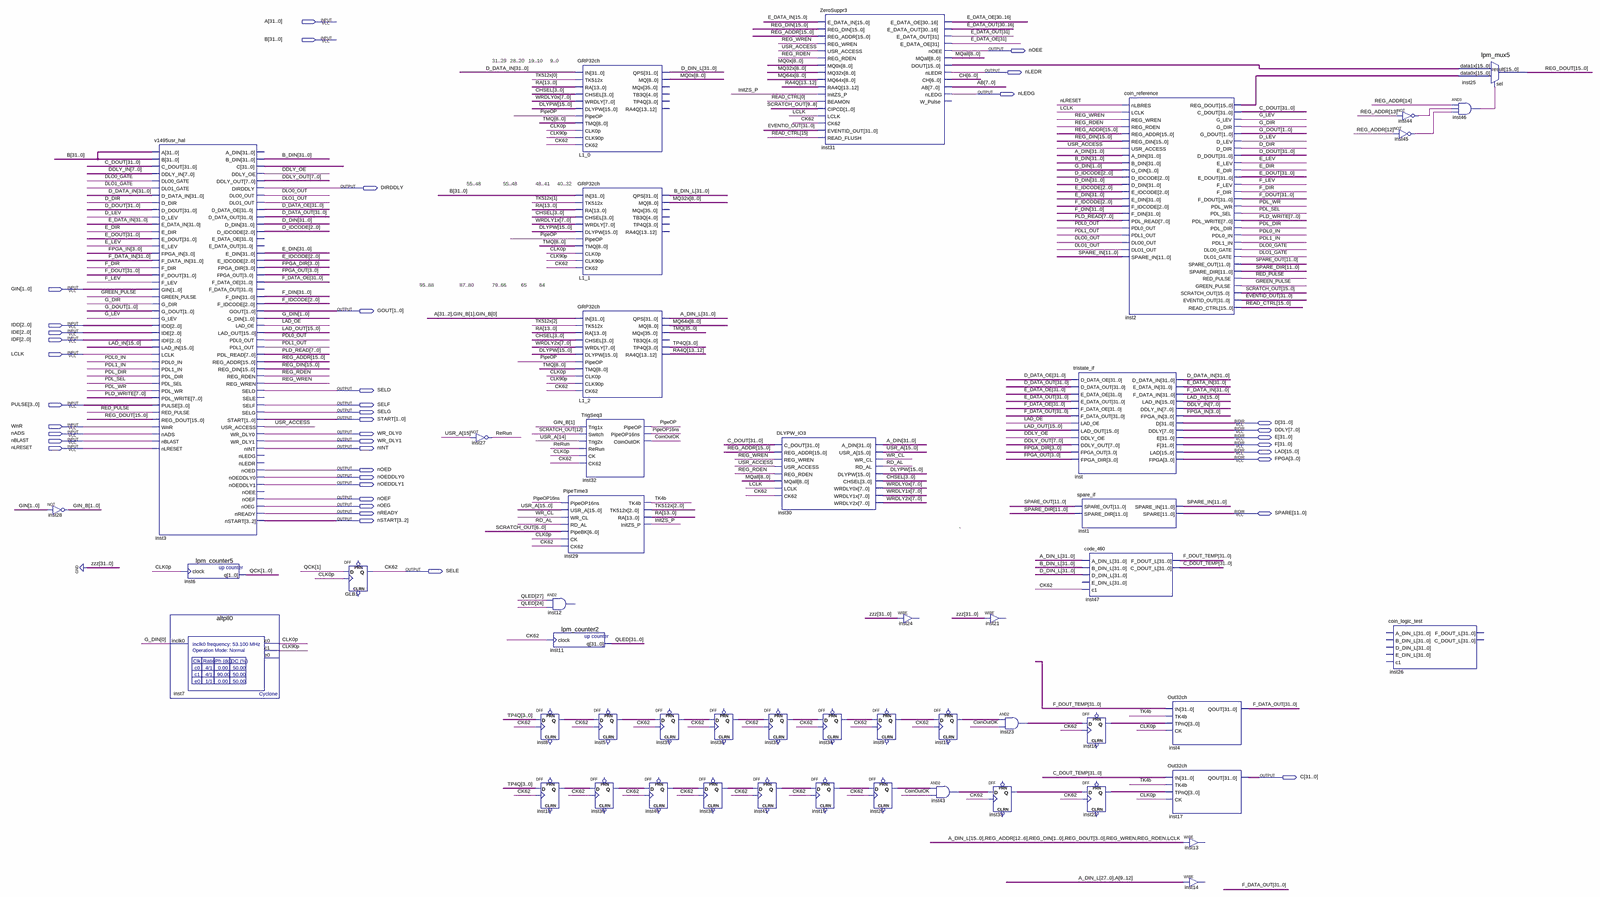
[diagram p0: schematic sheet, whole]
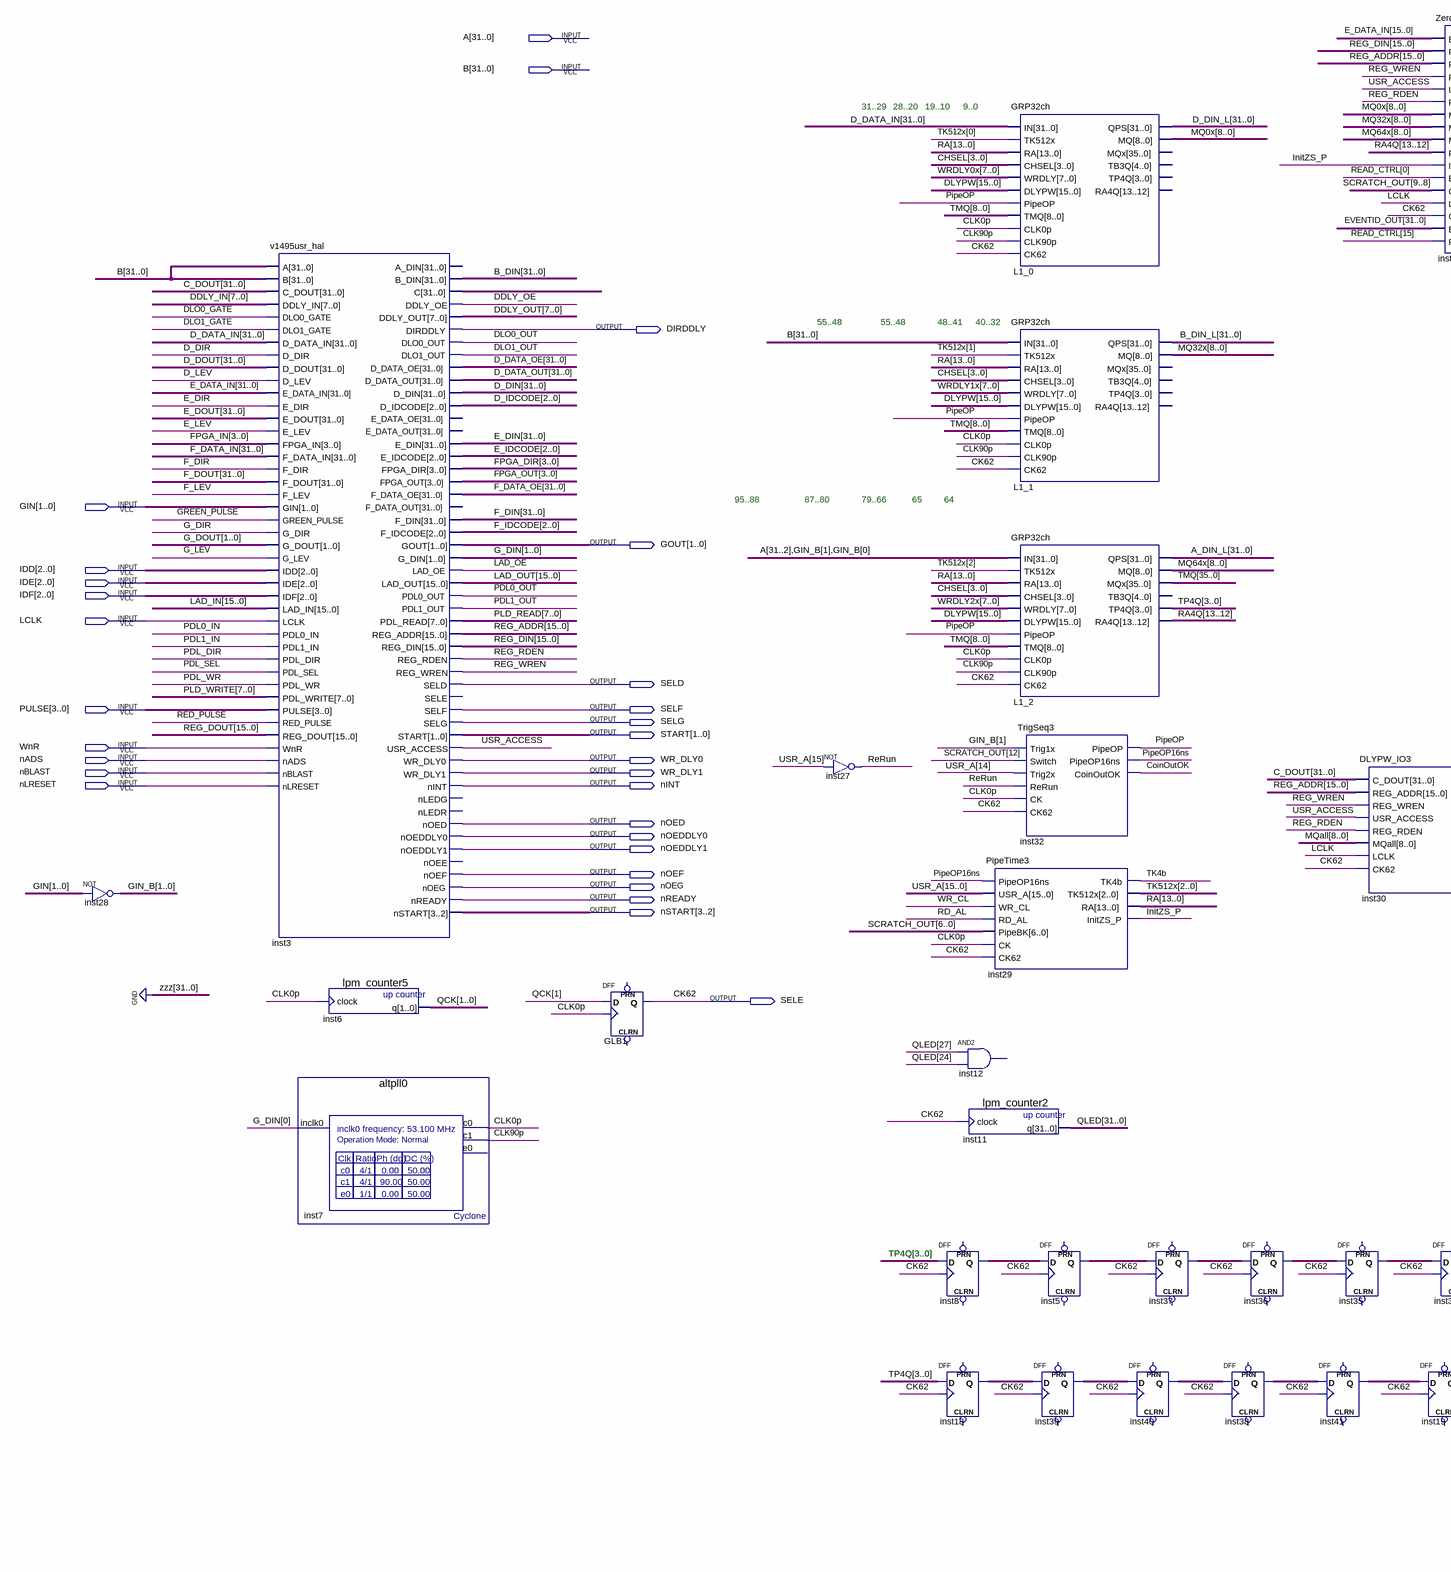
[diagram p1: schematic sheet, left part]
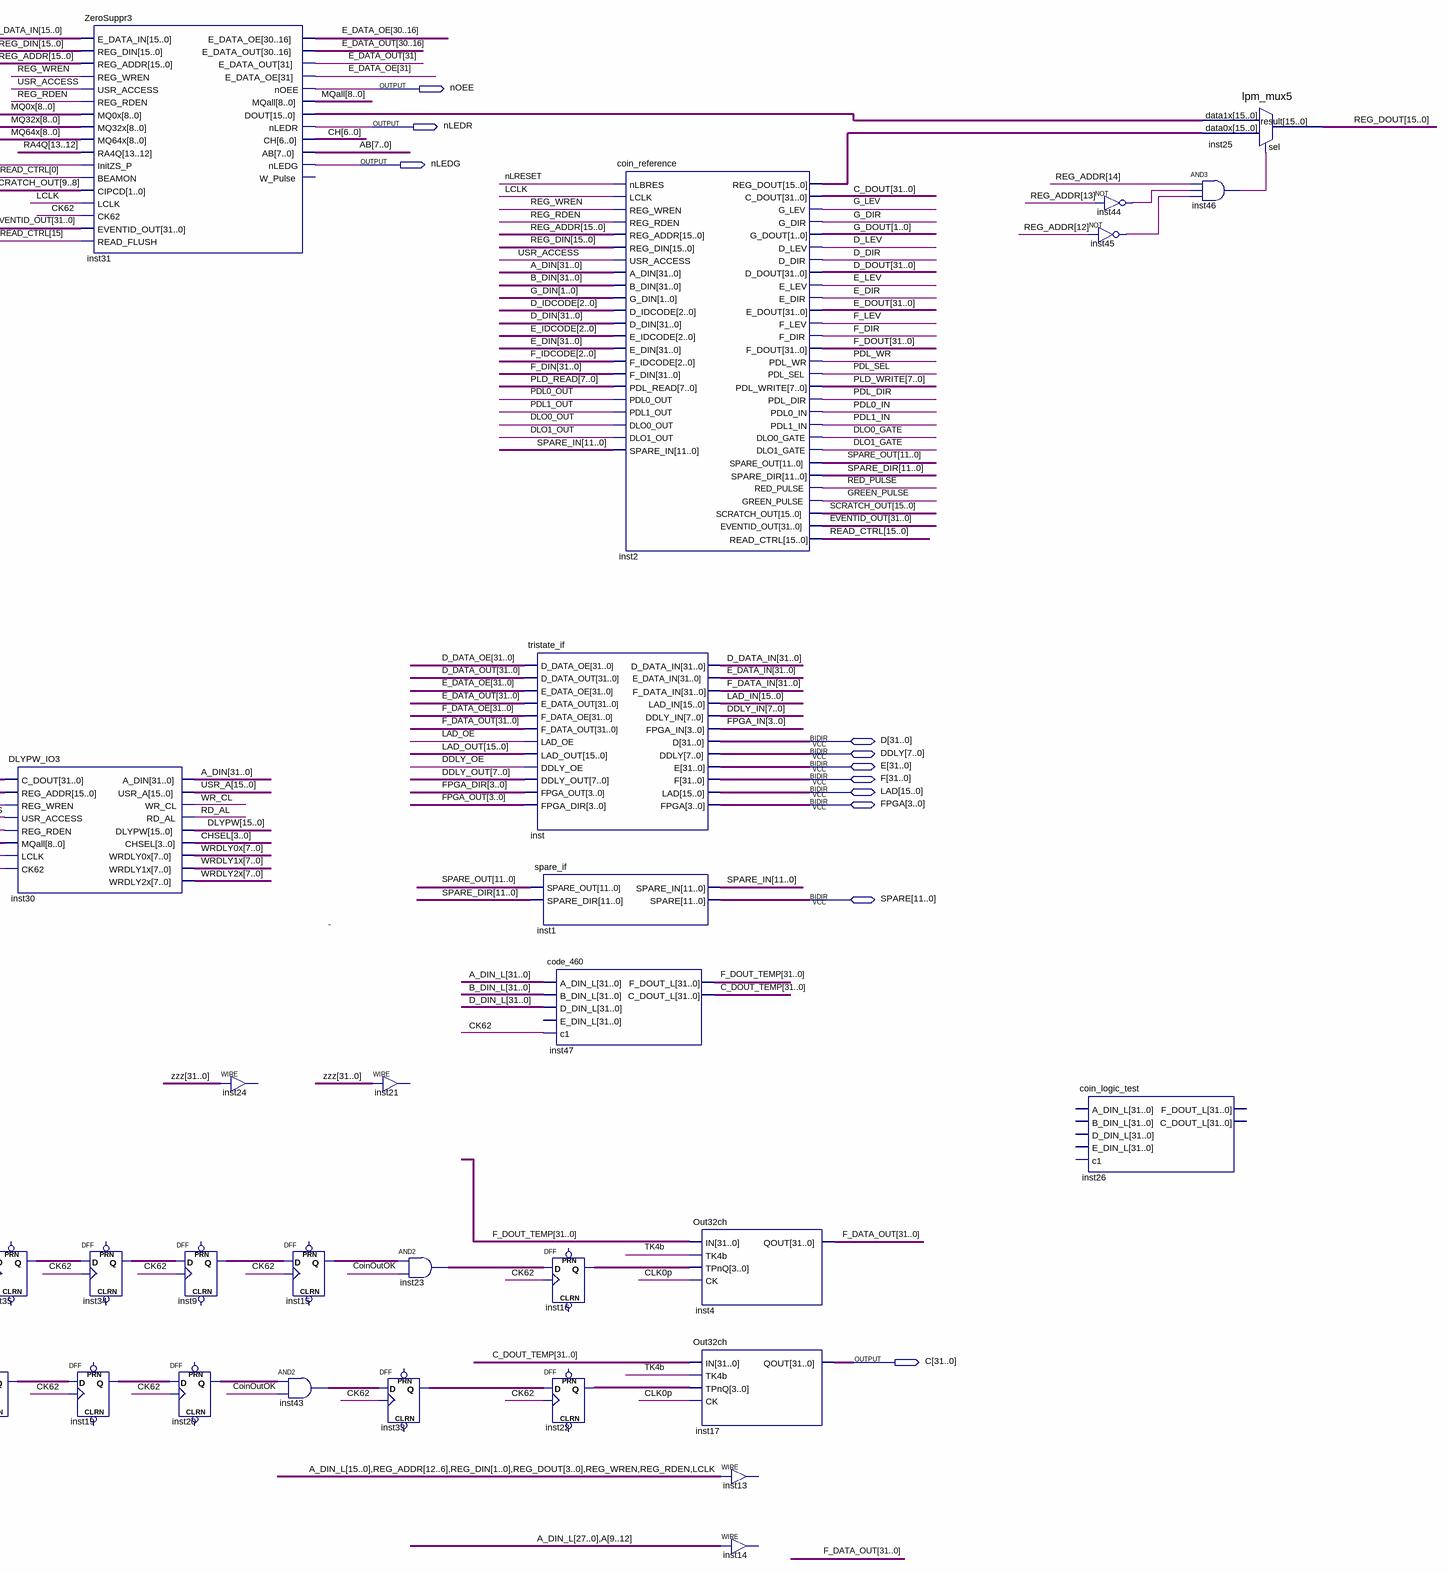
[diagram p2: schematic sheet, right part]
// Quartus schematic SeaQuestTrig2.bdf as structural Verilog: 50 symbols, 40 pins
module SeaQuestTrig2 (
  input  [31:0] A,
  input  [31:0] B,
  input  [1:0] GIN,
  input  [2:0] IDD,
  input  [2:0] IDE,
  input  [2:0] IDF,
  input  LCLK,
  input  [3:0] PULSE,
  input  WnR,
  input  nADS,
  input  nBLAST,
  input  nLRESET,
  inout  [31:0] D,
  inout  [7:0] DDLY,
  inout  [31:0] E,
  inout  [31:0] F,
  inout  [15:0] LAD,
  inout  [3:0] FPGA,
  inout  [11:0] SPARE,
  output nOEE,
  output nLEDR,
  output nLEDG,
  output DIRDDLY,
  output [1:0] GOUT,
  output SELD,
  output SELF,
  output SELG,
  output [1:0] START,
  output WR_DLY0,
  output WR_DLY1,
  output nINT,
  output nOED,
  output nOEDDLY0,
  output nOEDDLY1,
  output nOEF,
  output nOEG,
  output nREADY,
  output [3:2] nSTART,
  output SELE,
  output [31:0] C
);

  wire CLK0p, CLK90p, CoinOutOK, D_DIR, D_LEV, DDLY_OE, DLO0_GATE, DLO0_OUT, DLO1_GATE, DLO1_OUT, E_DIR,
       E_LEV, F_DIR, F_LEV, G_DIR, G_LEV, GREEN_PULSE, InitZS_P, inst44_out, inst45_out, inst46_out, LAD_OE,
       PDL0_IN, PDL0_OUT, PDL1_IN, PDL1_OUT, PDL_DIR, PDL_SEL, PDL_WR, PipeOP, PipeOP16ns, RD_AL, RED_PULSE,
       REG_RDEN, REG_WREN, ReRun, TK4b, USR_ACCESS, WR_CL;
  wire [1:0] G_DIN, G_DOUT, GIN_B, QCK;
  wire [2:0] D_IDCODE, E_IDCODE, F_IDCODE, TK512x;
  wire [3:0] CHSEL, FPGA_DIR, FPGA_IN, FPGA_OUT, inst5_q, inst8_q, inst9_q, inst15_q, inst16_q, inst18_q,
       inst19_q, inst20_q, inst22_q, inst23_out, inst33_q, inst34_q, inst35_q, inst36_q, inst37_q, inst38_q,
       inst39_q, inst40_q, inst41_q, inst43_out, TP4Q;
  wire [6:0] CH;
  wire [7:0] AB, DDLY_IN, DDLY_OUT, PLD_READ, PLD_WRITE, WRDLY0x, WRDLY1x, WRDLY2x;
  wire [8:0] MQ0x, MQ32x, MQ64x, MQall;
  wire [11:0] SPARE_DIR, SPARE_IN, SPARE_OUT;
  wire [13:0] RA;
  wire [13:12] RA4Q;
  wire [15:0] DLYPW, inst2_reg_dout, inst31_dout, LAD_IN, LAD_OUT, READ_CTRL, REG_ADDR, REG_DIN, REG_DOUT,
       SCRATCH_OUT, USR_A;
  wire [31:0] A_DIN, A_DIN_L, B_DIN, B_DIN_L, C_DOUT, C_DOUT_TEMP, D_DATA_IN, D_DATA_OE, D_DATA_OUT, D_DIN,
       D_DIN_L, D_DOUT, E_DATA_IN, E_DATA_OE, E_DATA_OUT, E_DIN, E_DOUT, EVENTID_OUT, F_DATA_IN, F_DATA_OE,
       F_DATA_OUT, F_DIN, F_DOUT, F_DOUT_TEMP, inst3_c, QLED;
  wire [35:0] TMQ;

  assign GIN_B = ~GIN;  // NOT inst28, 2 bits wide
  v1495usr_hal inst3 (
    .A(B), .B(B), .C_DOUT(C_DOUT), .DDLY_IN(DDLY_IN), .DLO0_GATE(DLO0_GATE), .DLO1_GATE(DLO1_GATE),
    .D_DATA_IN(D_DATA_IN), .D_DIR(D_DIR), .D_DOUT(D_DOUT), .D_LEV(D_LEV), .E_DATA_IN(E_DATA_IN),
    .E_DIR(E_DIR), .E_DOUT(E_DOUT), .E_LEV(E_LEV), .FPGA_IN(FPGA_IN), .F_DATA_IN(F_DATA_IN), .F_DIR(F_DIR),
    .F_DOUT(F_DOUT), .F_LEV(F_LEV), .GIN(GIN), .GREEN_PULSE(GREEN_PULSE), .G_DIR(G_DIR), .G_DOUT(G_DOUT),
    .G_LEV(G_LEV), .IDD(IDD), .IDE(IDE), .IDF(IDF), .LAD_IN(LAD_IN), .LCLK(LCLK), .PDL0_IN(PDL0_IN),
    .PDL1_IN(PDL1_IN), .PDL_DIR(PDL_DIR), .PDL_SEL(PDL_SEL), .PDL_WR(PDL_WR), .PDL_WRITE(PLD_WRITE),
    .PULSE(PULSE), .RED_PULSE(RED_PULSE), .REG_DOUT(REG_DOUT), .WnR(WnR), .nADS(nADS), .nBLAST(nBLAST),
    .nLRESET(nLRESET), .B_DIN(B_DIN), .C(inst3_c), .DDLY_OE(DDLY_OE), .DDLY_OUT(DDLY_OUT), .DIRDDLY(DIRDDLY),
    .DLO0_OUT(DLO0_OUT), .DLO1_OUT(DLO1_OUT), .D_DATA_OE(D_DATA_OE), .D_DATA_OUT(D_DATA_OUT), .D_DIN(D_DIN),
    .D_IDCODE(D_IDCODE), .E_DIN(E_DIN), .E_IDCODE(E_IDCODE), .FPGA_DIR(FPGA_DIR), .FPGA_OUT(FPGA_OUT),
    .F_DATA_OE(F_DATA_OE), .F_DIN(F_DIN), .F_IDCODE(F_IDCODE), .GOUT(GOUT), .G_DIN(G_DIN), .LAD_OE(LAD_OE),
    .LAD_OUT(LAD_OUT), .PDL0_OUT(PDL0_OUT), .PDL1_OUT(PDL1_OUT), .PDL_READ(PLD_READ), .REG_ADDR(REG_ADDR),
    .REG_DIN(REG_DIN), .REG_RDEN(REG_RDEN), .REG_WREN(REG_WREN), .SELD(SELD), .SELF(SELF), .SELG(SELG),
    .START(START), .USR_ACCESS(USR_ACCESS), .WR_DLY0(WR_DLY0), .WR_DLY1(WR_DLY1), .nINT(nINT), .nOED(nOED),
    .nOEDDLY0(nOEDDLY0), .nOEDDLY1(nOEDDLY1), .nOEF(nOEF), .nOEG(nOEG), .nREADY(nREADY), .nSTART(nSTART));  // open: A_DIN, E_DATA_OE, E_DATA_OUT, F_DATA_OUT, SELE, nLEDG, nLEDR, nOEE
  lpm_counter5 inst6 (.clock(CLK0p), .q(QCK));
  altpll0 inst7 (.inclk0(G_DIN[0]), .c0(CLK0p), .c1(CLK90p));  // open: e0
  DFF GLB1 (.CLK(CLK0p), .D(QCK[1]), .Q(SELE));  // open: CLRN, PRN
  not inst27 (ReRun, USR_A[15]);
  DFF inst8[3:0] (.CLK(SELE), .D(TP4Q), .Q(inst8_q));  // open: CLRN, PRN
  DFF inst18[3:0] (.CLK(SELE), .D(TP4Q), .Q(inst18_q));  // open: CLRN, PRN
  PipeTime3 inst29 (
    .PipeOP16ns(PipeOP16ns), .USR_A(USR_A), .WR_CL(WR_CL), .RD_AL(RD_AL), .PipeBK(SCRATCH_OUT[6:0]),
    .CK(CLK0p), .CK62(SELE), .TK4b(TK4b), .TK512x(TK512x), .RA(RA), .InitZS_P(InitZS_P));
  // AND2 inst12 has open pins: IN1=QLED[27], IN2=QLED[24], OUT=open
  lpm_counter2 inst11 (.clock(SELE), .q(QLED));
  GRP32ch L1_0 (
    .IN(D_DATA_IN), .TK512x(TK512x[0]), .RA(RA), .CHSEL(CHSEL), .WRDLY(WRDLY0x), .DLYPW(DLYPW),
    .PipeOP(PipeOP), .TMQ(TMQ[8:0]), .CLK0p(CLK0p), .CLK90p(CLK90p), .CK62(SELE), .QPS(D_DIN_L), .MQ(MQ0x));  // open: MQx, TB3Q, TP4Q, RA4Q
  GRP32ch L1_1 (
    .IN(B), .TK512x(TK512x[1]), .RA(RA), .CHSEL(CHSEL), .WRDLY(WRDLY1x), .DLYPW(DLYPW), .PipeOP(PipeOP),
    .TMQ(TMQ[8:0]), .CLK0p(CLK0p), .CLK90p(CLK90p), .CK62(SELE), .QPS(B_DIN_L), .MQ(MQ32x));  // open: MQx, TB3Q, TP4Q, RA4Q
  GRP32ch L1_2 (
    .IN({A[31:2], GIN_B}), .TK512x(TK512x[2]), .RA(RA), .CHSEL(CHSEL), .WRDLY(WRDLY2x), .DLYPW(DLYPW),
    .PipeOP(PipeOP), .TMQ(TMQ[8:0]), .CLK0p(CLK0p), .CLK90p(CLK90p), .CK62(SELE), .QPS(A_DIN_L), .MQ(MQ64x),
    .MQx(TMQ), .TP4Q(TP4Q), .RA4Q(RA4Q));  // open: TB3Q
  TrigSeq3 inst32 (
    .Trig1x(GIN_B[1]), .Switch(SCRATCH_OUT[12]), .Trig2x(USR_A[14]), .ReRun(ReRun), .CK(CLK0p), .CK62(SELE),
    .PipeOP(PipeOP), .PipeOP16ns(PipeOP16ns), .CoinOutOK(CoinOutOK));
  DFF inst5[3:0] (.CLK(SELE), .D(inst8_q), .Q(inst5_q));  // open: CLRN, PRN
  DFF inst39[3:0] (.CLK(SELE), .D(inst18_q), .Q(inst39_q));  // open: CLRN, PRN
  DFF inst37[3:0] (.CLK(SELE), .D(inst5_q), .Q(inst37_q));  // open: CLRN, PRN
  DFF inst40[3:0] (.CLK(SELE), .D(inst39_q), .Q(inst40_q));  // open: CLRN, PRN
  DFF inst36[3:0] (.CLK(SELE), .D(inst37_q), .Q(inst36_q));  // open: CLRN, PRN
  DFF inst38[3:0] (.CLK(SELE), .D(inst40_q), .Q(inst38_q));  // open: CLRN, PRN
  DFF inst35[3:0] (.CLK(SELE), .D(inst36_q), .Q(inst35_q));  // open: CLRN, PRN
  DFF inst41[3:0] (.CLK(SELE), .D(inst38_q), .Q(inst41_q));  // open: CLRN, PRN
  DLYPW_IO3 inst30 (
    .C_DOUT(C_DOUT), .REG_ADDR(REG_ADDR), .REG_WREN(REG_WREN), .USR_ACCESS(USR_ACCESS), .REG_RDEN(REG_RDEN),
    .MQall(MQall), .LCLK(LCLK), .CK62(SELE), .A_DIN(A_DIN), .USR_A(USR_A), .WR_CL(WR_CL), .RD_AL(RD_AL),
    .DLYPW(DLYPW), .CHSEL(CHSEL), .WRDLY0x(WRDLY0x), .WRDLY1x(WRDLY1x), .WRDLY2x(WRDLY2x));
  ZeroSuppr3 inst31 (
    .E_DATA_IN(E_DATA_IN[15:0]), .REG_DIN(REG_DIN), .REG_ADDR(REG_ADDR), .REG_WREN(REG_WREN),
    .USR_ACCESS(USR_ACCESS), .REG_RDEN(REG_RDEN), .MQ0x(MQ0x), .MQ32x(MQ32x), .MQ64x(MQ64x), .RA4Q(RA4Q),
    .InitZS_P(InitZS_P), .BEAMON(READ_CTRL[0]), .CIPCD(SCRATCH_OUT[9:8]), .LCLK(LCLK), .CK62(SELE),
    .EVENTID_OUT(EVENTID_OUT), .READ_FLUSH(READ_CTRL[15]), .E_DATA_OE(E_DATA_OE[31:16]),
    .E_DATA_OUT(E_DATA_OUT[31:16]), .nOEE(nOEE), .MQall(MQall), .DOUT(inst31_dout), .nLEDR(nLEDR), .CH(CH),
    .AB(AB), .nLEDG(nLEDG));  // open: W_Pulse
  DFF inst34[3:0] (.CLK(SELE), .D(inst35_q), .Q(inst34_q));  // open: CLRN, PRN
  DFF inst19[3:0] (.CLK(SELE), .D(inst41_q), .Q(inst19_q));  // open: CLRN, PRN
  DFF inst9[3:0] (.CLK(SELE), .D(inst34_q), .Q(inst9_q));  // open: CLRN, PRN
  DFF inst20[3:0] (.CLK(SELE), .D(inst19_q), .Q(inst20_q));  // open: CLRN, PRN
  // WIRE inst24 has open pins
  DFF inst15[3:0] (.CLK(SELE), .D(inst9_q), .Q(inst15_q));  // open: CLRN, PRN
  assign inst43_out = inst20_q & {4{CoinOutOK}};  // AND2 inst43, 4 bits wide
  // WIRE inst21 has open pins
  assign inst23_out = inst15_q & {4{CoinOutOK}};  // AND2 inst23, 4 bits wide
  DFF inst33[3:0] (.CLK(SELE), .D(inst43_out), .Q(inst33_q));  // open: CLRN, PRN
  tristate_if inst (
    .D_DATA_OE(D_DATA_OE), .D_DATA_OUT(D_DATA_OUT), .E_DATA_OE(E_DATA_OE), .E_DATA_OUT(E_DATA_OUT),
    .F_DATA_OE(F_DATA_OE), .F_DATA_OUT(F_DATA_OUT), .LAD_OE(LAD_OE), .LAD_OUT(LAD_OUT), .DDLY_OE(DDLY_OE),
    .DDLY_OUT(DDLY_OUT), .FPGA_OUT(FPGA_DIR), .FPGA_DIR(FPGA_OUT), .D_DATA_IN(D_DATA_IN),
    .E_DATA_IN(E_DATA_IN), .F_DATA_IN(F_DATA_IN), .LAD_IN(LAD_IN), .DDLY_IN(DDLY_IN), .FPGA_IN(FPGA_IN),
    .D(D), .DDLY(DDLY), .E(E), .F(F), .LAD(LAD), .FPGA(FPGA));
  spare_if inst1 (.SPARE_OUT(SPARE_OUT), .SPARE_DIR(SPARE_DIR), .SPARE_IN(SPARE_IN), .SPARE(SPARE));
  code_460 inst47 (
    .A_DIN_L(A_DIN_L), .B_DIN_L(B_DIN_L), .D_DIN_L(D_DIN_L), .c1(SELE), .F_DOUT_L(F_DOUT_TEMP),
    .C_DOUT_L(C_DOUT_TEMP));  // open: E_DIN_L
  DFF inst16[3:0] (.CLK(SELE), .D(inst23_out), .Q(inst16_q));  // open: CLRN, PRN
  DFF inst22[3:0] (.CLK(SELE), .D(inst33_q), .Q(inst22_q));  // open: CLRN, PRN
  coin_reference inst2 (
    .nLBRES(nLRESET), .LCLK(LCLK), .REG_WREN(REG_WREN), .REG_RDEN(REG_RDEN), .REG_ADDR(REG_ADDR),
    .REG_DIN(REG_DIN), .USR_ACCESS(USR_ACCESS), .A_DIN(A_DIN), .B_DIN(B_DIN), .G_DIN(G_DIN),
    .D_IDCODE(D_IDCODE), .D_DIN(D_DIN), .E_IDCODE(E_IDCODE), .E_DIN(E_DIN), .F_IDCODE(F_IDCODE),
    .F_DIN(F_DIN), .PDL_READ(PLD_READ), .PDL0_OUT(PDL0_OUT), .PDL1_OUT(PDL1_OUT), .DLO0_OUT(DLO0_OUT),
    .DLO1_OUT(DLO1_OUT), .SPARE_IN(SPARE_IN), .REG_DOUT(inst2_reg_dout), .C_DOUT(C_DOUT), .G_LEV(G_LEV),
    .G_DIR(G_DIR), .G_DOUT(G_DOUT), .D_LEV(D_LEV), .D_DIR(D_DIR), .D_DOUT(D_DOUT), .E_LEV(E_LEV),
    .E_DIR(E_DIR), .E_DOUT(E_DOUT), .F_LEV(F_LEV), .F_DIR(F_DIR), .F_DOUT(F_DOUT), .PDL_WR(PDL_WR),
    .PDL_SEL(PDL_SEL), .PDL_WRITE(PLD_WRITE), .PDL_DIR(PDL_DIR), .PDL0_IN(PDL0_IN), .PDL1_IN(PDL1_IN),
    .DLO0_GATE(DLO0_GATE), .DLO1_GATE(DLO1_GATE), .SPARE_OUT(SPARE_OUT), .SPARE_DIR(SPARE_DIR),
    .RED_PULSE(RED_PULSE), .GREEN_PULSE(GREEN_PULSE), .SCRATCH_OUT(SCRATCH_OUT), .EVENTID_OUT(EVENTID_OUT),
    .READ_CTRL(READ_CTRL));
  Out32ch inst4 (.IN(F_DOUT_TEMP), .TK4b(TK4b), .TPnQ(inst16_q), .CK(CLK0p), .QOUT(F_DATA_OUT));
  Out32ch inst17 (.IN(C_DOUT_TEMP), .TK4b(TK4b), .TPnQ(inst22_q), .CK(CLK0p), .QOUT(C));
  // WIRE inst13 has open pins
  // WIRE inst14 has open pins
  not inst44 (inst44_out, REG_ADDR[13]);
  not inst45 (inst45_out, REG_ADDR[12]);
  coin_logic_test inst26 ();  // open: A_DIN_L, B_DIN_L, D_DIN_L, E_DIN_L, c1, F_DOUT_L, C_DOUT_L
  lpm_mux5 inst25 (.data1x(inst31_dout), .data0x(inst2_reg_dout), .sel(inst46_out), .result(REG_DOUT));
  and inst46 (inst46_out, REG_ADDR[14], inst44_out, inst45_out);

  // Other names for the same wires on the sheet: CK62 = SELE

  // Notes on the sheet:
  //   31..29
  //   28..20
  //   19..10
  //   9..0
  //   55..48
  //   55..48
  //   48..41
  //   40..32
  //   95..88
  //   87..80
  //   79..66
  //   65
  //   64
  //   -
  //   TP4Q[3..0]
endmodule
